# EAGLE design polarTRX (EAGLE 6.5.0)

## Sheet 1 of 2
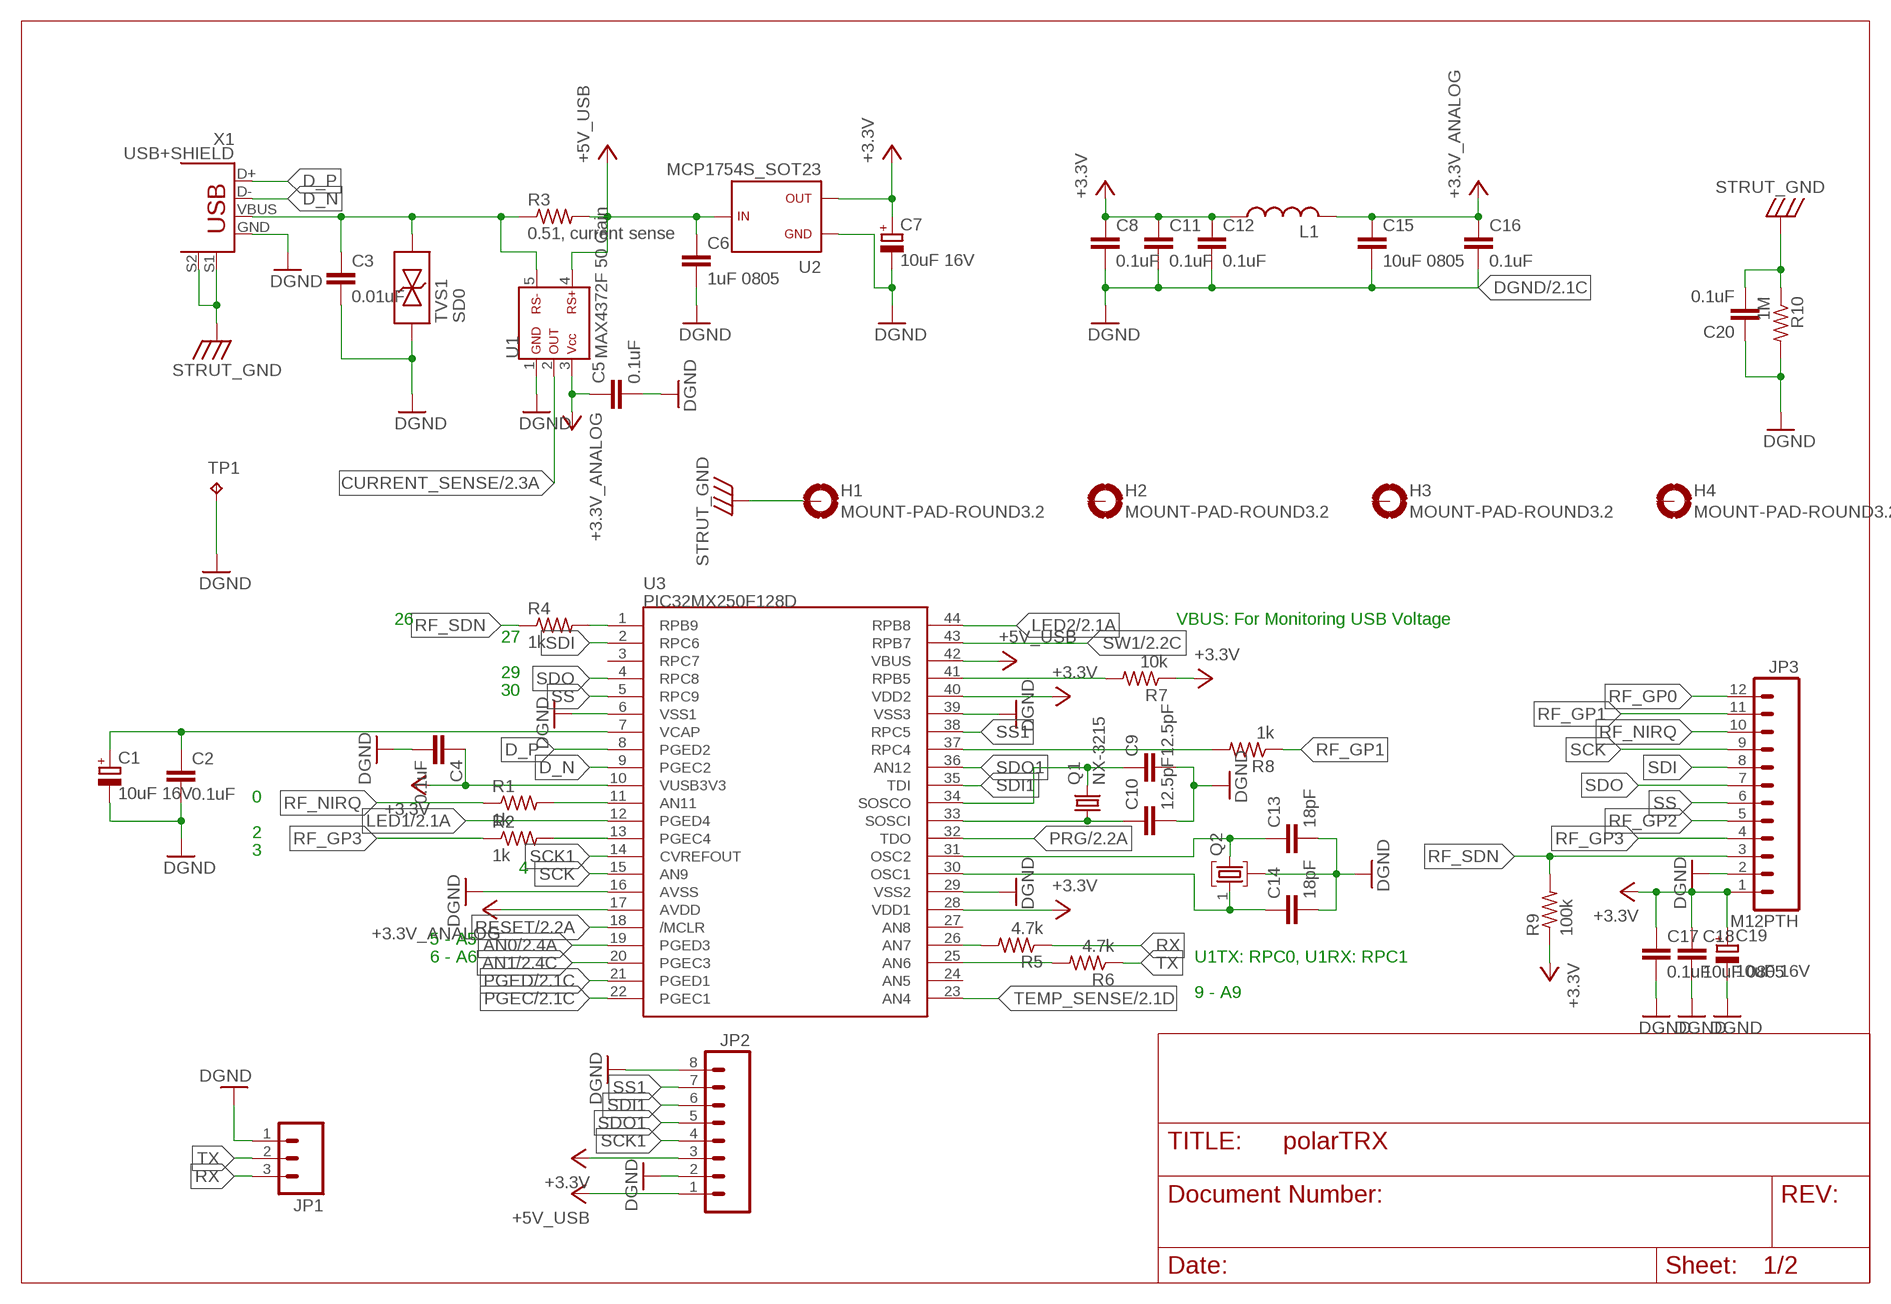
[diagram p0: schematic, sheet 1]

### Parts
C1  10uF 16V  C-TANTAL-A  [C1206(3216)-A]
C2  0.1uF  C0603(1608)  [C0603(1608)]
C3  0.01uF  C0603(1608)  [C0603(1608)]
C4  0.1uF  C0603(1608)  [C0603(1608)]
C5  0.1uF  C0603(1608)  [C0603(1608)]
C6  1uF 0805  C0805(2012)  [C0805(2012)]
C7  10uF 16V  C-TANTAL-A  [C1206(3216)-A]
C8  0.1uF  C0603(1608)  [C0603(1608)]
C9  12.5pF  C0603(1608)  [C0603(1608)]
C10  12.5pF  C0603(1608)  [C0603(1608)]
C11  0.1uF  C0603(1608)  [C0603(1608)]
C12  0.1uF  C0603(1608)  [C0603(1608)]
C13  18pF  C0603(1608)  [C0603(1608)]
C14  18pF  C0603(1608)  [C0603(1608)]
C15  10uF 0805  C0805(2012)  [C0805(2012)]
C16  0.1uF  C0603(1608)  [C0603(1608)]
C17  0.1uF  C0603(1608)  [C0603(1608)]
C18  10uF 0805  C0805(2012)  [C0805(2012)]
C19  10uF 16V  C-TANTAL-A  [C1206(3216)-A]
C20  0.1uF  C0603(1608)  [C0603(1608)]
H1  MOUNT-PAD-ROUND3.2  [3,2-PAD]
H2  MOUNT-PAD-ROUND3.2  [3,2-PAD]
H3  MOUNT-PAD-ROUND3.2  [3,2-PAD]
H4  MOUNT-PAD-ROUND3.2  [3,2-PAD]
JP1  M03PTH  [1X03]
JP2  M08SILK_FEMALE_PTH  [1X08]
JP3  M12PTH  [1X12]
L1  L0805(2012)  [L0805(2012)]
Q1  NX-3215  [NX-3215]
Q2  CRYSTAL  [HC_49US]
R1  1k  R0603(1608)  [R0603(1608)]
R2  1k  R0603(1608)  [R0603(1608)]
R3  0.51, current sense  R0805(2012)  [R0805(2012)]
R4  1k  R0603(1608)  [R0603(1608)]
R5  4.7k  R0603(1608)  [R0603(1608)]
R6  4.7k  R0603(1608)  [R0603(1608)]
R7  10k  R0603(1608)  [R0603(1608)]
R8  1k  R0603(1608)  [R0603(1608)]
R9  100k  R0603(1608)  [R0603(1608)]
R10  1M  R0603(1608)  [R0603(1608)]
TP1  TP  [TP-13]
TVS1  SD0  [SOD-323-NOPOL]
U1  MAX4372F 50 Gain  MAX4372  [SOT23-5DBV]
U2  MCP1754S_SOT23  [SOT23]
U3  PIC32MX250F128D  [TQFP44]
X1  USB+SHIELD  [USB-B-PTH]

### Nets
+3.3V: C4.1 C7.1(+) C8.1 C11.1 C12.1 C17.1 C18.1 C19.1(+) JP2.3 JP3.1 L1.1 R7.1 R9.1 U2.2 U3.10(VUSB3V3) U3.28(VDD1) U3.40(VDD2) ; also sheet 2
+3.3V_ANALOG: C5.1 C15.1 C16.1 L1.2 U1.3 U3.17(AVDD) ; also sheet 2
+5V_USB: C6.1 JP2.1 R3.2 U1.4 U2.3 U3.42(VBUS) ; also sheet 2
AN0: U3.19(PGED3) ; also sheet 2
AN1: U3.20(PGEC3) ; also sheet 2
CURRENT_SENSE: U1.2 ; also sheet 2
D_N: U3.9(PGEC2) X1.D-
D_P: U3.8(PGED2) X1.D+
DGND: C1.2(-) C2.2 C3.2 C4.2 C5.2 C6.2 C7.2(-) C8.2 C9.2 C10.2 C11.2 C12.2 C13.2 C14.2 C15.2 C16.2 C17.2 C18.2 C19.2(-) C20.1 JP1.1 JP2.2 JP2.8 JP3.2 Q2.2 R10.2 TP1.TP TVS1.1 U1.1 U2.1 U3.6(VSS1) U3.16(AVSS) U3.29(VSS2) U3.39(VSS3) X1.GND ; also sheet 2
LED1: U3.12(PGED4) ; also sheet 2
LED2: U3.44(RPB8) ; also sheet 2
N$4: C13.1 Q2.3 U3.31(OSC2)
N$5: C1.1(+) C2.1 U3.7(VCAP)
N$6: C14.1 Q2.1 U3.30(OSC1)
N$7: C3.1 R3.1 TVS1.2 U1.5 X1.VBUS
N$9: R1.2 U3.11(AN11)
N$10: R2.2 U3.13(PGEC4)
N$11: C9.1 Q1.2 U3.34(SOSCO)
N$12: C10.1 Q1.1 U3.33(SOSCI)
N$13: R8.2 U3.37(RPC4)
N$14: R6.2 U3.25(AN6)
N$15: R5.2 U3.26(AN7)
N$16: R7.2 U3.41(RPB5)
N$20: R4.2 U3.1(RPB9)
PGEC: U3.22(PGEC1) ; also sheet 2
PGED: U3.21(PGED1) ; also sheet 2
PRG: U3.32(TDO) ; also sheet 2
RESET: U3.18(/MCLR) ; also sheet 2
RF_GP0: JP3.12
RF_GP1: JP3.11 R8.1
RF_GP2: JP3.5
RF_GP3: JP3.4 R2.1
RF_NIRQ: JP3.10 R1.1
RF_SDN: JP3.3 R4.1 R9.2
RX: JP1.3 R5.1
SCK: JP3.9 U3.15(AN9)
SCK1: JP2.4 U3.14(CVREFOUT)
SDI: JP3.8 U3.2(RPC6)
SDI1: JP2.6 U3.35(TDI)
SDO: JP3.7 U3.4(RPC8)
SDO1: JP2.5 U3.36(AN12)
SS: JP3.6 U3.5(RPC9)
SS1: JP2.7 U3.38(RPC5)
STRUT_GND: C20.2 H1.B3,2(MOUNT) R10.1 X1.S1 X1.S2
SW1: U3.43(RPB7) ; also sheet 2
TEMP_SENSE: U3.23(AN4) ; also sheet 2
TX: JP1.2 R6.1
Unconnected: H2.B3,2(MOUNT) H3.B3,2(MOUNT) H4.B3,2(MOUNT) U3.3(RPC7) U3.24(AN5) U3.27(AN8)

### Notes on the sheet
- 26 | VBUS: For Monitoring USB Voltage
- 27
- 29
- 30
- 0
- 2
- 3
- 4
- 5 - A5
- 6 - A6 | U1TX: RPC0, U1RX: RPC1
- 9 - A9

## Sheet 2 of 2
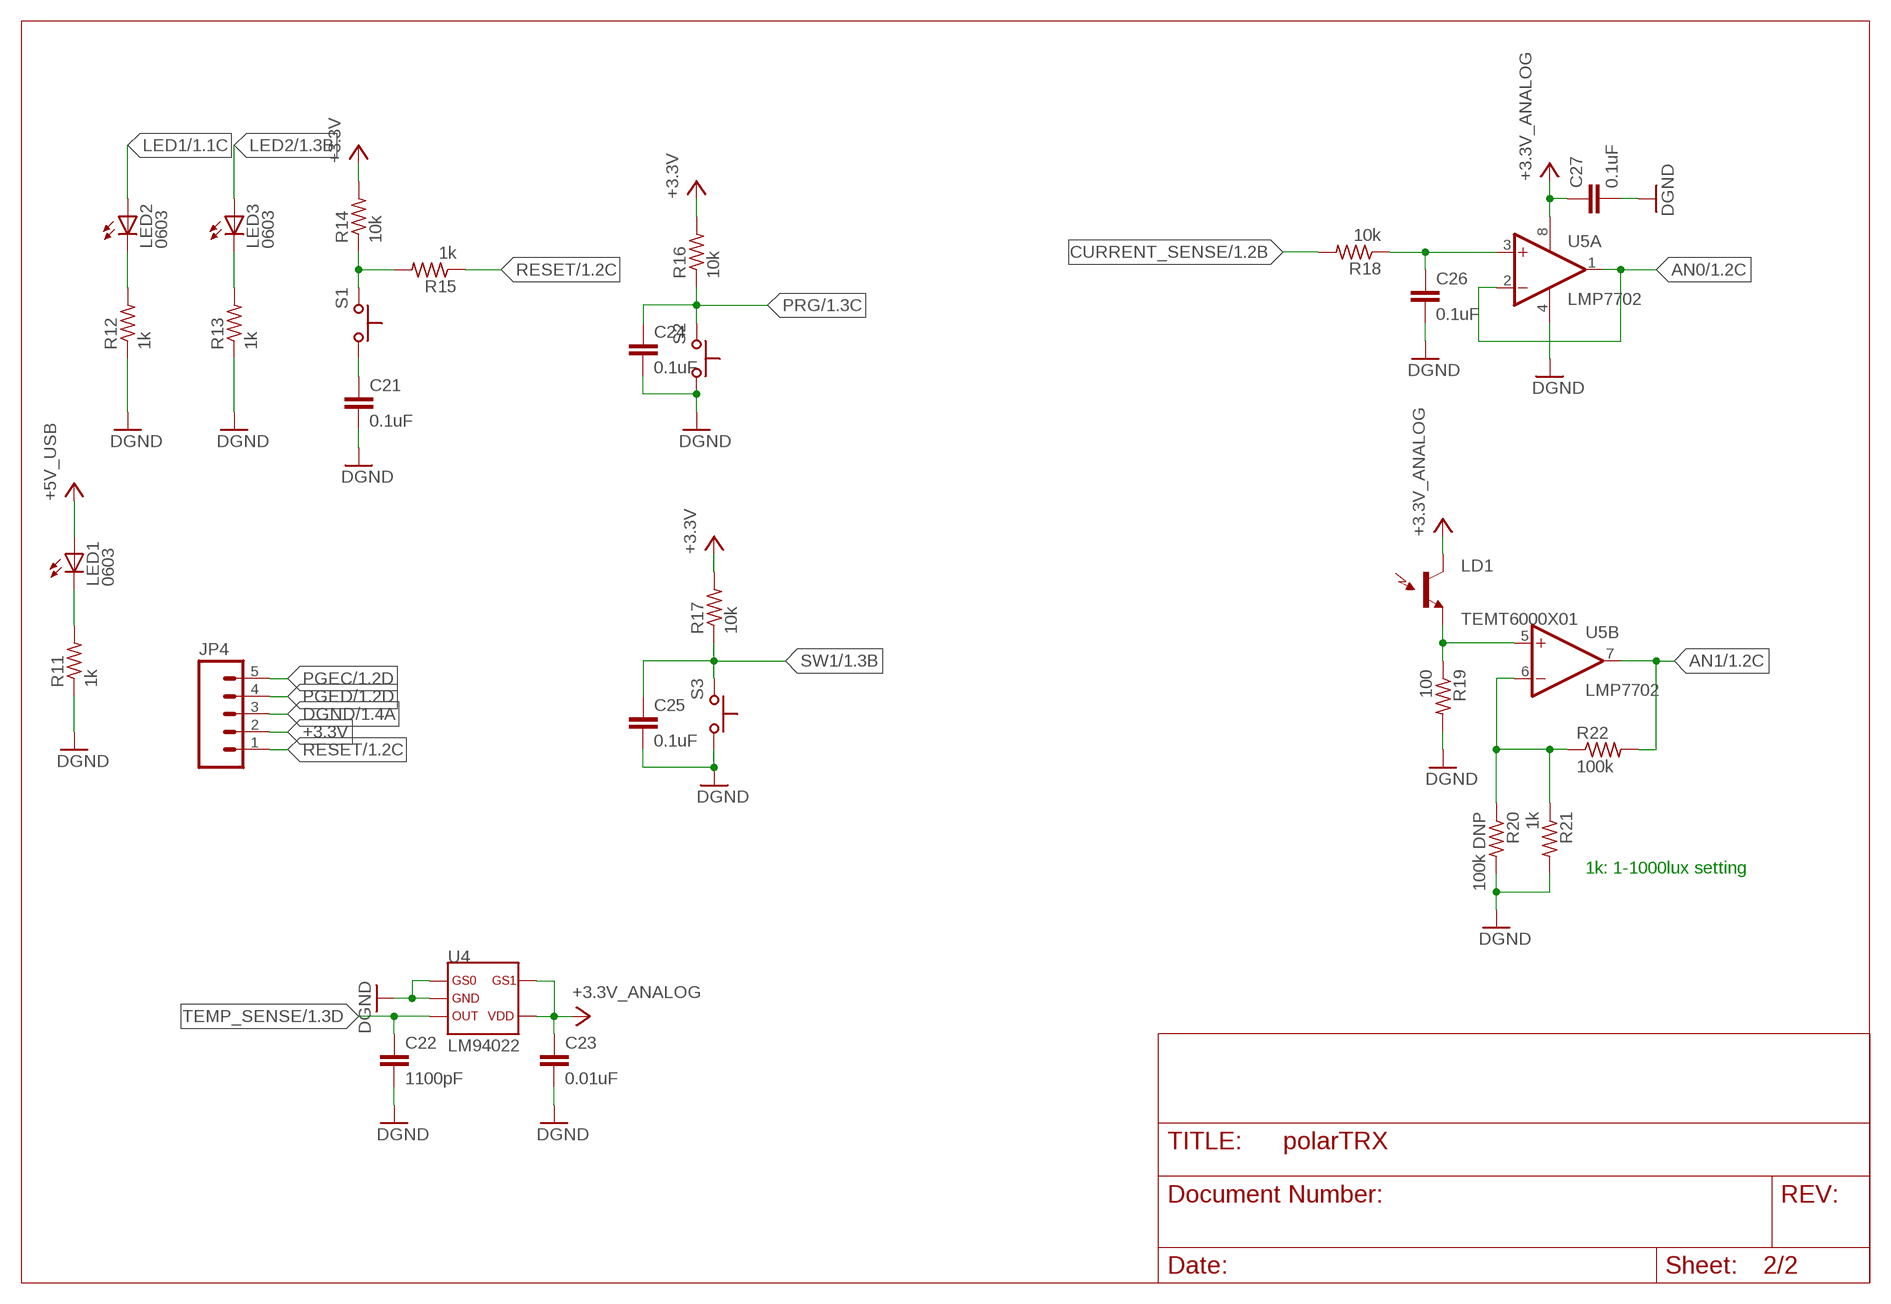
[diagram p1: schematic, sheet 2]

### Parts
C21  0.1uF  C0603(1608)  [C0603(1608)]
C22  1100pF  C0603(1608)  [C0603(1608)]
C23  0.01uF  C0603(1608)  [C0603(1608)]
C24  0.1uF  C0603(1608)  [C0603(1608)]
C25  0.1uF  C0603(1608)  [C0603(1608)]
C26  0.1uF  C0603(1608)  [C0603(1608)]
C27  0.1uF  C0603(1608)  [C0603(1608)]
JP4  M05PTH  [1X05]
LD1  TEMT6000X01  [TEMT6000-SEN]
LED1  0603  LED0603  [LED-0603]
LED2  0603  LED0603  [LED-0603]
LED3  0603  LED0603  [LED-0603]
R11  1k  R0603(1608)  [R0603(1608)]
R12  1k  R0603(1608)  [R0603(1608)]
R13  1k  R0603(1608)  [R0603(1608)]
R14  10k  R0603(1608)  [R0603(1608)]
R15  1k  R0603(1608)  [R0603(1608)]
R16  10k  R0603(1608)  [R0603(1608)]
R17  10k  R0603(1608)  [R0603(1608)]
R18  10k  R0603(1608)  [R0603(1608)]
R19  100  R0603(1608)  [R0603(1608)]
R20  100k DNP  R0603(1608)  [R0603(1608)]
R21  1k  R0603(1608)  [R0603(1608)]
R22  100k  R0603(1608)  [R0603(1608)]
S1  SWITCH  [SKHLACA010]
S2  SWITCH  [SKHLACA010]
S3  SWITCH  [SKHLACA010]
U4  LM94022  [SC70-5]
U5  LMP7702  [DGK_S-DPSO-G8]

### Nets
+3.3V: JP4.2 R14.2 R16.2 R17.2 ; also sheet 1
+3.3V_ANALOG: C23.1 C27.1 LD1.COLLECTOR(C1) U4.4 U4.5 U5.8(V+) ; also sheet 1
+5V_USB: LED1.A ; also sheet 1
AN0: U5.1(A:OUT) U5.2(A:-IN) ; also sheet 1
AN1: R22.2 U5.7(B:OUT) ; also sheet 1
CURRENT_SENSE: R18.2 ; also sheet 1
DGND: C21.2 C22.2 C23.2 C24.2 C25.2 C26.2 C27.2 JP4.3 R11.1 R12.1 R13.1 R19.2 R20.2 R21.2 S2.P$2 S3.P$2 U4.1 U4.2 U5.4(V-) ; also sheet 1
LED1: LED2.A ; also sheet 1
LED2: LED3.A ; also sheet 1
N$1: R14.1 R15.2 S1.P$1
N$2: C21.1 S1.P$2
N$17: LED1.C R11.2
N$18: LED2.C R12.2
N$19: LED3.C R13.2
N$21: C26.1 R18.1 U5.3(A:+IN)
N$22: LD1.EMITTER(E1) R19.1 U5.5(B:+IN)
N$23: R20.1 R21.1 R22.1 U5.6(B:-IN)
PGEC: JP4.5 ; also sheet 1
PGED: JP4.4 ; also sheet 1
PRG: C24.1 R16.1 S2.P$1 ; also sheet 1
RESET: JP4.1 R15.1 ; also sheet 1
SW1: C25.1 R17.1 S3.P$1 ; also sheet 1
TEMP_SENSE: C22.1 U4.3 ; also sheet 1

### Notes on the sheet
- 1k: 1-1000lux setting

## Library data of the parts
C1 C7 C19 = berry:C-TANTAL-A: TAJA105M020RNJ Tantal Capacitor Manufacturer: AVX 1206(3126) Ref: www.avx.com/docs/techinfo/tantappl.pdf
C2-C6 C8-C18 C21-C27 = polarinstruments:C
C20 = yBrainDigital:C
H1-H4 = yBrainDigital:MOUNT-PAD-ROUND: MOUNTING PAD, round
JP1 = SparkFun-Connectors:M03: Header 3 Standard 3-pin 0.1" header. Use with straight break away headers (SKU : PRT-00116), right angle break away headers (PRT-00553), swiss pins (PRT-00743), machine pins (PRT-00117), and female headers (PRT-00115). Molex polarized connector foot print use with SKU : PRT-08232 with associated crimp pins and housings.
JP2 = SparkFun-Connectors:M08: Header 8 Standard 8-pin 0.1" header. Use with straight break away headers (SKU : PRT-00116), right angle break away headers (PRT-00553), swiss pins (PRT-00743), machine pins (PRT-00117), and female headers (PRT-00115).; PROD_ID: CONN-08438
JP3 = SparkFun-Connectors:M12: Header 12 Standard 12-pin 0.1" header. Use with straight break away headers (SKU : PRT-00116), right angle break away headers (PRT-00553), swiss pins (PRT-00743), machine pins (PRT-00117), and female headers (PRT-00115).
JP4 = SparkFun-Connectors:M05: Header 5 Standard 5-pin 0.1" header. Use with straight break away headers (SKU : PRT-00116), right angle break away headers (PRT-00553), swiss pins (PRT-00743), machine pins (PRT-00117), and female headers (PRT-00115). Molex polarized connector foot print use with SKU : PRT-08230 with associated crimp pins and housings.
L1 = polarinstruments:L
LD1 = polarinstruments:TEMT6000: Ambient Light Sensor Simple light detection sensor. Output varies with light intensity input. Spark Fun Electronics SKU : COM-08348
LED1-LED3 = SparkFun:LED: LEDs Standard schematic elements and footprints for 5mm, 3mm, 1206, and 0603 sized LEDs. 5mm - Spark Fun Electronics SKU : COM-00529 (and others)
Q1 = polarinstruments:NX-3215: NDK 32.768 kHz SMD Crystal P/N: NX3215SA-32.768K-STD-MUS-2 Nominal frequency (kHz): 32.768 Package Size (L×W×H : mm): 3.2×1.5×0.8 Operating Temperature Range(*1) / Storage Temperature Range (°C): -40 to +85 / -40 to +85 Level of drive: 0.1µW (Max. 0.5µW) Frequency Tolerance (25±3°C): ±20×10-6 Load Capacitance: 9.0pF, 12.5pF Equivalent Series Resistance: 70kΩ Max. Ordering Code: NX3215SA-32.768K-STD-MUA-9 (Load Capacitance9.0pF) /NX3215SA-32.768K-STD-MUA-8 (Load Capacitance12.5pF)
Q2 = polarinstruments:CRYSTAL
R1-R9 R11-R22 = polarinstruments:R
R10 = yBrainDigital:R
S1-S3 = polarinstruments:SWITCH
TP1 = polarinstruments:TP
TVS1 = polarinstruments:SD0
U1 = polarinstruments:MAX4372
U2 = polarinstruments:MCP1754S: MCP1754s high PSRR LDO from Microchips
U3 = polarinstruments:PIC32MX250F128D
U4 = polarinstruments:LM94022: LM94022 Temp Sensor From TI
U5 = polarinstruments:LMP7702
X1 = polarinstruments:USB+SHIELD: USB+Shield USB connector with shield pins connectable

## Board
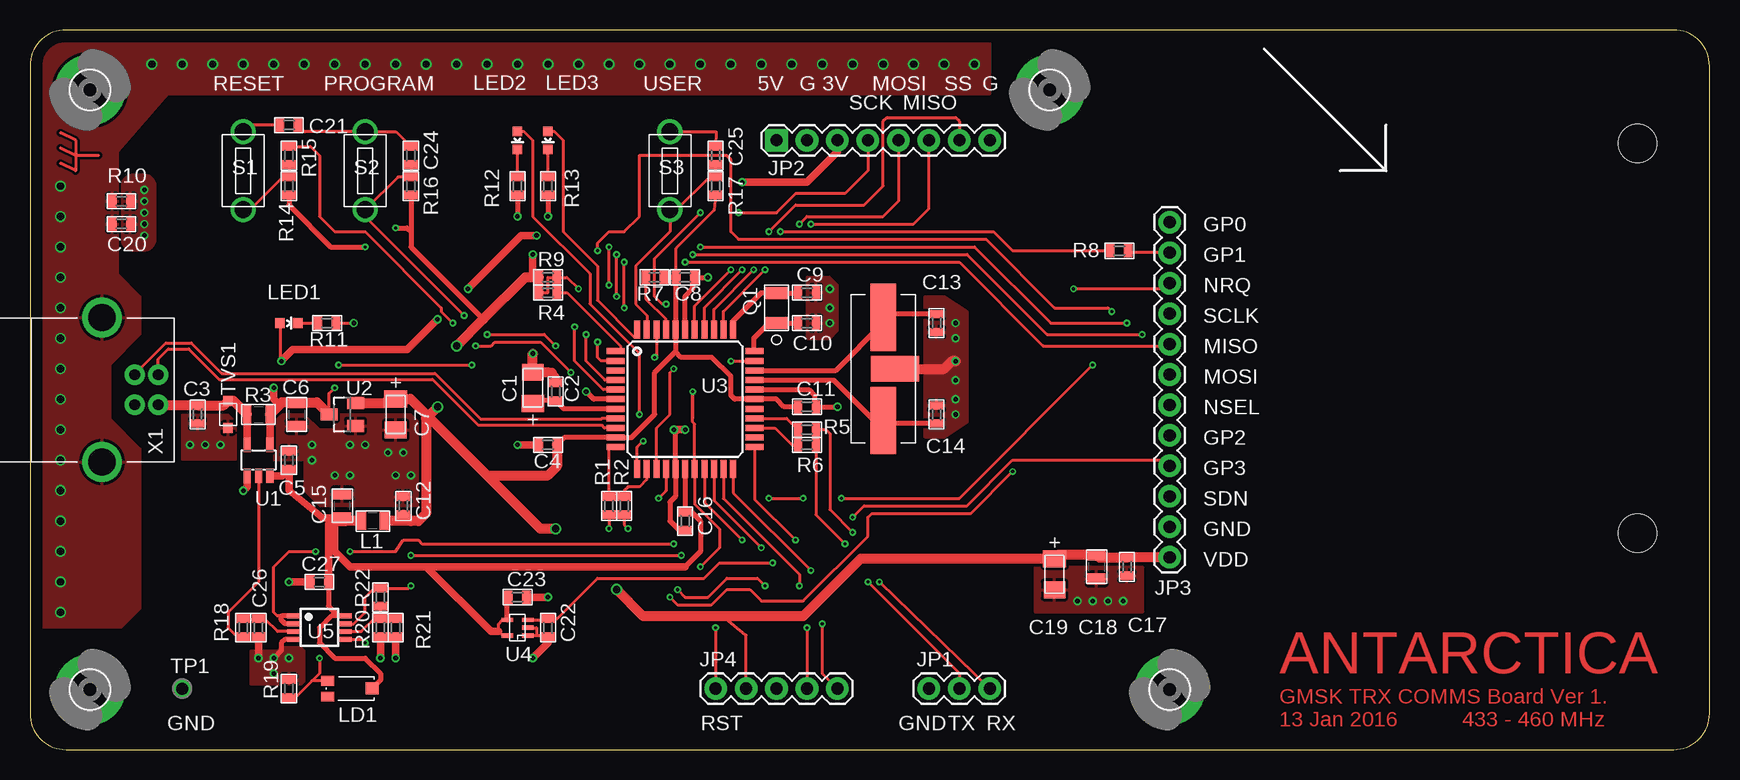
[diagram p2: board, top side]
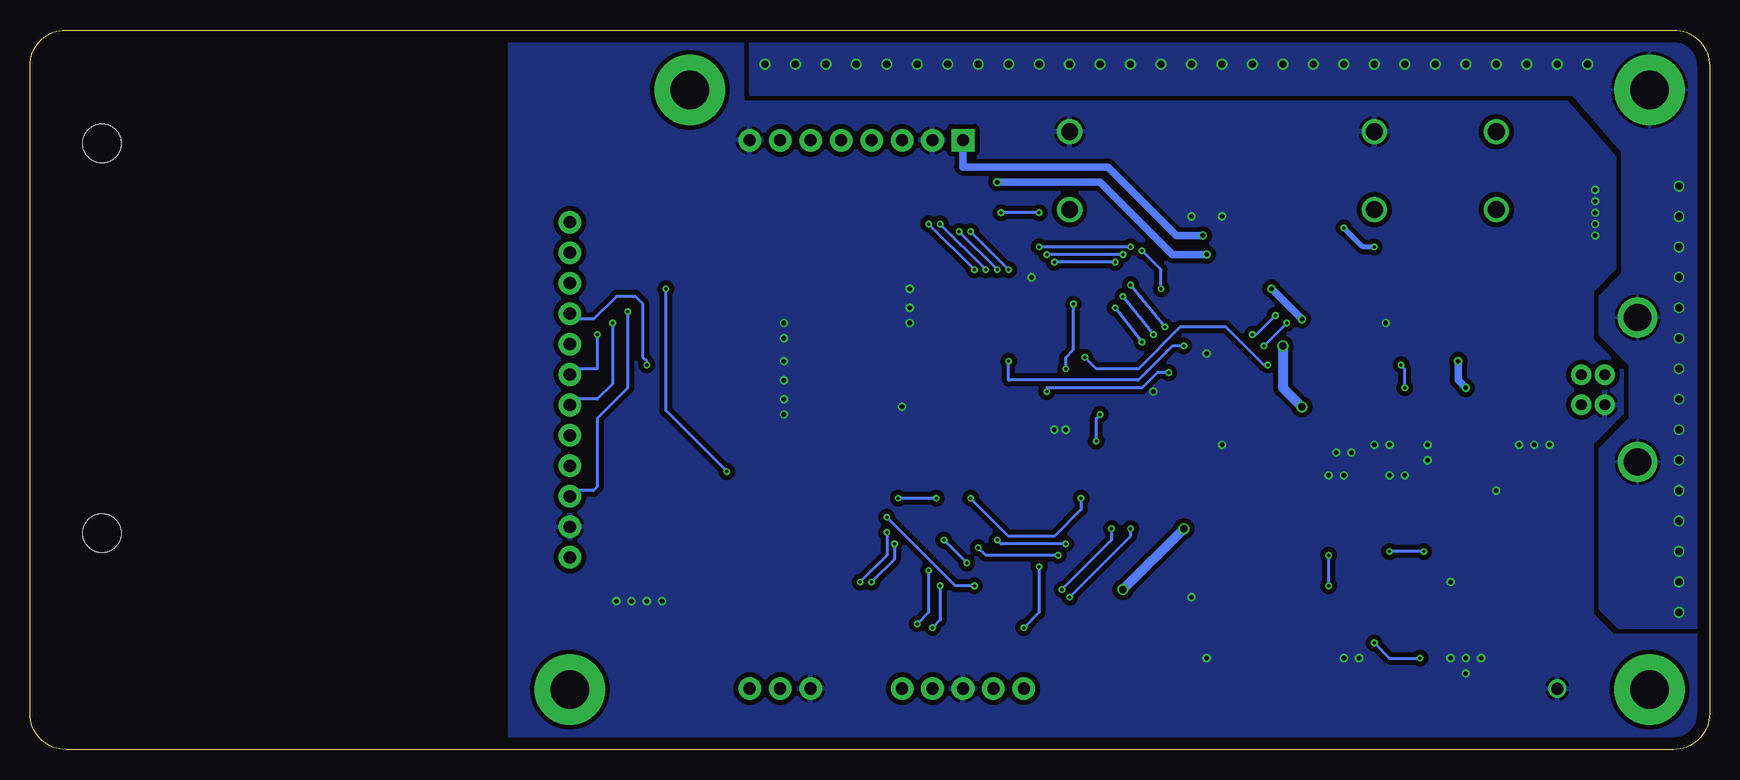
[diagram p3: board, bottom side, seen from below]

Size 140 x 60 mm. Coordinates in mm from the lower left corner, seen from the top.
Outline: 3,0 137,0 arc90 140,3 140,57 arc90 137,60 3,60 arc90 0,57 0,3 arc90 3,0
Copper layers (1*16): Top 0.035mm / dielectric 1.5mm / Bottom 0.035mm
Design rules "default *": minimum track width 10mil, minimum drill 10mil, track to track 8mil, track to pad 8mil, pad to pad 8mil, via to via 8mil, smd to smd 8mil, copper to edge 40mil, drill to drill 8mil, minimum pad ring 10mil, minimum via ring 6mil, stop-mask expansion 4mil, vias tented up to drill 0mil, thermal gap 10mil
Holes 3.2 mm at 134,18.03 134,50.53

### Footprints (pad centres in the part's own frame; a part is rotated, then mirrored left to right if it is on the bottom)
C1206(3216)-A = smd 1.4 x 1.9: 1 -1.3,0 | smd 1.4 x 1.8: 2 1.3,0
C0603(1608) = smd 0.7 x 1.1: 1 -0.75,0; 2 0.75,0
C0805(2012) = smd 0.9 x 1.5: 1 -1,0; 2 1,0
3,2-PAD = drill 3.2 pad 5.842: B3,2 0,0
1X03 = drill 1.016 pad 1.88: 1 0,0; 2 2.54,0; 3 5.08,0
1X08 = drill 1.016 pad 1.88 square: 1 0,0 | drill 1.016 pad 1.88: 2 2.54,0; 3 5.08,0; 4 7.62,0; 5 10.16,0; 6 12.7,0; 7 15.24,0; 8 17.78,0
1X12 = drill 1.016 pad 1.88: 1 0,0; 2 2.54,0; 3 5.08,0; 4 7.62,0; 5 10.16,0; 6 12.7,0; 7 15.24,0; 8 17.78,0; 9 20.32,0; 10 22.86,0; 11 25.4,0; 12 27.94,0
1X05 = drill 1.016 pad 1.88: 1 0,0; 2 2.54,0; 3 5.08,0; 4 7.62,0; 5 10.16,0
L0805(2012) = smd 0.9 x 1.5: 1 -1,0; 2 1,0
TEMT6000-SEN = smd 1.1 x 0.8: BASE -1.87,-0.65; EMITTER -1.87,0.65 | smd 1.1 x 1: COLLECTOR 1.86,0.01
LED-0603 = smd 0.8 x 0.8: A 0,-0.75; C 0,0.75
NX-3215 = smd 1 x 1.8: 1 -1.25,0; 2 1.25,0
HC_49US = smd 5.6 x 2.1: 1 -4.3,0; 3 4.3,0 | smd 2.1 x 4: 2 0,-1
R0603(1608) = smd 0.7 x 1.1: 1 -0.75,0; 2 0.75,0
R0805(2012) = smd 0.7 x 1.5: 1 -0.95,0; 2 0.95,0
SKHLACA010 = drill 1.4: P$1 -3.25,0; P$2 3.25,0
TP-13 = drill 1: TP 0,0
SOD-323-NOPOL = smd 0.8 x 0.8: 1 -1.125,0; 2 1.125,0
SOT23-5DBV = smd 0.6 x 1.22: 1 -0.95,-1.3; 2 0,-1.3; 3 0.95,-1.3; 4 0.95,1.3; 5 -0.95,1.3
SOT23 = smd 1 x 1.4: 1 -0.95,-1.1; 2 0.95,-1.1; 3 0,1.1
TQFP44 = smd 1.5 x 0.5: 1 -5.8,4; 2 -5.8,3.2; 3 -5.8,2.4; 4 -5.8,1.6; 5 -5.8,0.8; 6 -5.8,0; 7 -5.8,-0.8; 8 -5.8,-1.6; 9 -5.8,-2.4; 10 -5.8,-3.2; 11 -5.8,-4; 23 5.8,-4; 24 5.8,-3.2; 25 5.8,-2.4; 26 5.8,-1.6; 27 5.8,-0.8; 28 5.8,0; 29 5.8,0.8; 30 5.8,1.6; 31 5.8,2.4; 32 5.8,3.2; 33 5.8,4 | smd 0.5 x 1.5: 12 -4,-5.8; 13 -3.2,-5.8; 14 -2.4,-5.8; 15 -1.6,-5.8; 16 -0.8,-5.8; 17 0,-5.8; 18 0.8,-5.8; 19 1.6,-5.8; 20 2.4,-5.8; 21 3.2,-5.8; 22 4,-5.8; 34 4,5.8; 35 3.2,5.8; 36 2.4,5.8; 37 1.6,5.8; 38 0.8,5.8; 39 0,5.8; 40 -0.8,5.8; 41 -1.6,5.8; 42 -2.4,5.8; 43 -3.2,5.8; 44 -4,5.8
SC70-5 = smd 0.36 x 0.95: 1 -0.65,-0.85; 2 0,-0.85; 3 0.65,-0.85; 4 0.65,0.85; 5 -0.65,0.85
DGK_S-DPSO-G8 = smd 0.4 x 1: 1 -0.975,-2.2; 2 -0.325,-2.2; 3 0.325,-2.2; 4 0.975,-2.2; 5 0.975,2.2; 6 0.325,2.2; 7 -0.325,2.2; 8 -0.975,2.2
USB-B-PTH = drill 0.914 pad 1.676: D+ 2.718,1.25; D- 4.699,1.25; GND 2.718,-1.25; VBUS 4.699,-1.25 | drill 2.286: S1 0,-6.02; S2 0,6.02

### Placement (x,y rotation side)
C1  41.91,30.16 90 top
C2  43.81,29.84 90 top
C3  13.97,27.94 270 top
C4  43.18,25.4 180 top
C5  21.59,24.13 90 top
C6  22.23,27.94 270 top
C7  30.48,27.94 270 top
C8  54.61,39.37 0 top
C9  64.77,38.1 0 top
C10  64.77,35.56 0 top
C11  64.77,28.57 0 top
C12  31.11,20.32 90 top
C13  75.56,35.56 270 top
C14  75.56,27.94 90 top
C15  26.04,20.32 90 top
C16  54.61,19.05 270 top
C17  91.44,15.24 270 top
C18  88.9,15.24 270 top
C19  85.41,14.61 270 top
C20  7.62,43.81 180 top
C21  21.59,52.07 0 top
C22  43.18,10.16 270 top
C23  40.64,12.7 0 top
C24  31.75,49.53 90 top
C25  57.15,49.53 90 top
C26  19.05,10.16 270 top
C27  24.13,13.97 180 top
H1  5,55 0 top
H2  85,55 0 top
H3  5,5 0 top
H4  95,5 0 top
JP1  74.93,5.08 0 top
JP2  62.23,50.8 0 top
JP3  95,16.03 90 top
JP4  57.15,5.08 0 top
L1  28.57,19.05 180 top
LD1  26.67,5.08 0 top
LED1  21.59,35.56 270 top
LED2  40.64,50.8 180 top
LED3  43.18,50.8 180 top
Q1  62.23,36.83 90 top
Q2  71.12,31.75 90 top
R1  48.26,20.32 90 top
R2  49.53,20.32 90 top
R3  19.05,27.94 0 top
R4  43.18,38.1 0 top
R5  64.77,26.67 180 top
R6  64.77,25.4 180 top
R7  52.07,39.37 180 top
R8  90.81,41.59 180 top
R9  43.18,39.37 0 top
R10  7.62,45.72 0 top
R11  24.77,35.56 180 top
R12  40.64,46.99 90 top
R13  43.18,46.99 90 top
R14  21.59,46.99 270 top
R15  21.59,49.53 270 top
R16  31.75,46.99 270 top
R17  57.15,46.99 270 top
R18  17.78,10.16 270 top
R19  21.59,5.08 90 top
R20  29.21,10.16 270 top
R21  30.48,10.16 270 top
R22  29.21,12.7 90 top
S1  17.78,48.26 90 top
S2  27.94,48.26 90 top
S3  53.34,48.26 90 top
TP1  12.7,5.08 0 top
TVS1  16.51,27.94 90 top
U1  19.05,24.13 0 top
U2  26.04,27.94 90 top
U3  54.61,29.21 0 top
U4  40.64,10.16 90 top
U5  24.13,10.16 270 top
X1  6,30 0 top

### Tracks (layer width: path | path; a pad name or v marks a point on that pad's centre or on a via)
+3.3V  (via drill 0.25, 0.38, 0.61)
  Top 0.254: JP4.2 59.69,9.53 57.78,11.11 | R17.2 57.03,44.97 53.86,41.8 C8.1
  Top 0.406: C4.1 44.54,26.01 U3.10 50.14,26.01 52.07,27.94 52.07,31.43 53.81,33.17 | R7.1 C8.1 53.86,35.01 U3.40 53.81,33.17 | C11.1 62.87,28.57 62.23,29.21 U3.28 58.74,29.21 58.42,29.53 58.42,31.11 56.83,32.7 54.28,32.7 53.81,33.17 | R16.2 31.75,43.18 | 31.75,43.18 31.75,41.91 37.78,35.88 | R14.2 21.59,45.4 25.08,41.91 v27.94,41.91 | v30.48,43.5 31.43,43.5 31.75,43.18
  Top 0.61: JP2.3 67.31,49.85 64.77,47.31 v59.37,47.31 | v41.91,41.27 41.91,39.37
  Top 0.813: U2.2 29.5,28.89 C7.1 31.72,29.24 33.02,27.94 | 33.02,27.94 33.02,27.62 | 33.02,27.62 33.02,19.68 32.38,19.05 31.75,19.05 | 31.75,19.05 L1.1 | C12.1 31.75,19.05 | JP3.1 91.48,16.03 C17.1 89.15,15.99 C18.1 85.74,16.24 C19.1 69.25,15.9 64.45,11.11 57.78,11.11 51.12,11.11 v48.9,13.34 | 33.02,27.94 38.1,22.86 | 38.1,22.86 43.18,22.86 43.93,23.61 C4.1 | v43.81,18.41 42.55,18.41 38.1,22.86 | R9.1 41.91,39.37 41.27,39.37 37.78,35.88 v35.56,33.66 | v33.97,28.57 33.02,27.62
  Bottom 0.406: v27.94,41.91 28.89,41.91 v30.48,43.5
  Bottom 0.61: v59.37,47.31 50.8,47.31 44.77,41.27 v41.91,41.27
  Bottom 0.813: v48.9,13.34 v43.81,18.41 | v35.56,33.66 35.56,30.16 v33.97,28.57
+3.3V_ANALOG
  Top 0.254: U4.5 39.38,9.51 39.05,9.84 39.05,10.48 39.37,10.79 39.77,10.79 U4.4
  Top 0.406: U3.17 C16.1 55.13,19.8 55.88,19.05 55.88,16.51 54.61,15.24 | C27.1 24.88,11.95 25.7,11.13 U5.8 25.11,11.13 24.13,10.16 24.13,8.89 25.4,7.62 27.94,7.62 29.21,6.35 29.21,5.77 LD1.COLLECTOR | U4.4 39.79,12.6 C23.1
  Top 0.61: U1.3 21.04,22.83 C5.1 21.59,21.59 24.38,19.32 25.4,19.32 | C15.1 25.4,19.32 | C27.1 24.88,18.8 25.4,19.32 | 39.05,9.84 38.42,9.84 33.02,15.24 | 33.02,15.24 26.67,15.24 25.4,16.51 25.4,19.05 | 54.61,15.24 33.02,15.24
  Top 0.813: L1.2 26.3,19.05 | 25.4,19.05 26.3,19.05 | 26.3,19.05 C15.1
+5V_USB  (via drill 0.25, 0.38)
  Top 0.254: U2.3 24.93,29.7 v25.4,30.16 | v25.72,32.07 v36.83,32.07 | U3.42 52.21,32.84 v52.07,32.7 | LED1.A 20.84,32.5 v20.95,32.38
  Top 0.61: U1.4 R3.2 | v42.23,42.86 40.96,42.86 v36.51,38.42 | v33.97,35.88 31.43,33.34 21.91,33.34 v20.95,32.38 | v20.32,30.16 20.32,29.21 20.8,28.73
  Top 0.813: R3.2 20.8,28.73 21,28.94 C6.1 23.93,28.94 U2.3
  Bottom 0.254: v25.4,30.16 25.4,31.75 v25.72,32.07 | v36.83,32.07 37.15,32.07 40.32,35.24 44.13,35.24 47.62,31.75 51.12,31.75 v52.07,32.7
  Bottom 0.61: JP2.1 62.23,48.58 50.16,48.58 44.45,42.86 v42.23,42.86 | v36.51,38.42 v33.97,35.88 | v20.95,32.38 20.95,30.8 v20.32,30.16
AN0  (via drill 0.25)
  Top 0.254: U3.19 56.21,20.62 v59.37,17.46 | U5.1 20.61,11.13 20.32,11.43 20.32,15.24 21.59,16.51 v23.81,16.51 | v26.67,16.51 30.48,16.51 31.11,17.46 32.38,17.46 32.7,17.14 v53.66,17.14
  Top 0.406: U5.2 21.27,10.48 20.95,10.79 20.95,11.11 20.98,11.13 U5.1
  Bottom 0.254: v23.81,16.51 v26.67,16.51 | v53.66,17.14 59.05,17.14 v59.37,17.46
AN1  (via drill 0.25)
  Top 0.254: U5.7 27,10.48 27.94,11.43 27.94,12.7 28.69,13.45 R22.2 31.55,13.45 v31.75,13.65 | U3.20 57.01,20.78 v60.96,16.83 | v31.75,16.19 v54.29,16.19
  Bottom 0.254: v31.75,13.65 v31.75,16.19 | v54.29,16.19 60.33,16.19 v60.96,16.83
CURRENT_SENSE
  Top 0.254: U1.2 19.05,13.97 16.51,11.43 16.51,10.16 17.26,9.41 R18.2
D_N
  Top 0.254: X1.D- 10.7,32.56 11.54,33.4 13.23,33.4 15.77,30.86 33.55,30.86 37.36,27.05 47.62,27.05 47.87,26.81 U3.9
D_P
  Top 0.254: X1.D+ 8.72,31.3 11.32,33.91 13.44,33.91 15.98,31.37 33.76,31.37 37.57,27.56 47.62,27.56 47.68,27.61 U3.8
DGND  (via drill 0.38)
  Top 0.254: S3.P$2 57.19,51.51 C25.2 | C24.2 30.52,51.51 S2.P$2 22.9,51.51 C21.2 | U4.1 42.23,9.51 | 42.23,9.51 42.56,9.51 43.18,8.89 | U4.2 42.23,10.16 42.23,9.51 | R11.1 v26.99,35.56
  Top 0.406: C16.2 54.09,18.3 53.34,19.05 53.34,20.64 53.81,21.11 U3.16 53.81,26.5 v54.61,26.67 | U5.4 21.25,9.19 20.95,8.89 20.95,8.26 v20.32,7.62 | U3.29 64.92,30.01 65.41,29.53 65.41,28.69 C11.2 v67.31,28.57 | U3.6 46.99,29.21 v46.35,29.84 | v56.52,39.37 C8.2 55.36,38.85 55.24,38.73 55.24,38.42 54.61,37.78 U3.39 | R12.1 v40.64,44.45 | R13.1 v43.18,44.45
  Top 0.61: U1.1 18.1,21.91 v17.78,21.59 | C23.2 v43.18,12.7 | C22.2 43.18,8.89 v41.91,7.62 | R20.2 v29.21,7.62 | R21.2 v30.48,7.62 | C26.2 v19.05,7.62 | C27.2 v21.59,13.97 | v54.61,26.67 v53.66,26.67 | C4.2 v40.64,25.4 | C2.2 43.81,31.11 43.5,31.43
  Top 0.813: Q2.2 76.2,31.75 76.83,32.38 v77.15,32.38 | v41.91,33.02 C1.2 43.15,31.46 43.5,31.43
  other vias: 30.48,22.86 29.84,24.77 26.67,22.86 31.75,22.86 25.4,22.86 23.5,25.4 26.67,25.4 27.94,25.4 23.5,24.13 31.11,24.77 13.34,25.4 14.61,25.4 15.88,25.4 66.67,35.56 66.67,36.83 66.67,38.42 77.15,35.56 77.15,27.94 77.15,29.21 77.15,30.8 77.15,34.29 9.53,45.72 9.53,43.81 9.53,44.77 9.53,46.67 9.53,42.86 87.31,12.38 88.58,12.38 89.85,12.38 91.12,12.38 21.59,7.62 20.32,6.35
  pour Top: 30.48,27.94 25.4,27.94 25.4,26.67 24.13,26.67 22.86,27.94 20.32,27.94 20.32,24.13 22.86,24.13 22.86,21.59 24.13,20.32 33.02,20.32 33.02,26.67 31.75,27.94
  pour Bottom (isolate 0.406, rank 2): 0,60.33 100,60.33 100,-0.64 0,-0.64
  pour Top: 12.7,27.94 16.51,27.94 17.14,27.3 17.14,24.13 12.7,24.13
  pour Top: 64.77,39.37 64.77,34.29 66.67,34.29 67.31,34.92 67.31,38.73 66.67,39.37
  pour Top: 74.61,37.78 76.2,37.78 78.11,36.51 78.11,27.3 76.2,26.04 74.61,26.04
  pour Top (rank 2): 7.62,46.94 7.62,42.59 arc90 8.62,41.59 9.48,41.59 arc90 10.48,42.59 10.48,46.94 arc90 9.48,47.94 8.62,47.94 arc90
  pour Top: 83.82,15.24 92.71,15.24 92.71,11.43 83.82,11.43
  pour Top: 18.41,8.26 20.64,8.26 20.95,8.57 22.54,8.57 22.86,8.26 22.86,5.4 18.41,5.4
LED1  (via drill 0.25)
  Top 0.254: LED2.A 41.16,51.55 41.91,50.8 41.91,44.45 46.67,39.69 46.67,37.15 50.8,33.02 v50.8,27.94 | U3.12 50.61,25.21 v51.12,25.72
  Bottom 0.254: v51.12,25.72 51.12,27.62 v50.8,27.94
LED2
  Top 0.254: LED3.A 43.7,51.55 44.45,50.8 44.45,43.18 47.31,40.32 47.31,37.47 50.4,34.38 50.61,34.59 U3.44
N$1
  Top 0.254: S1.P$1 18.34,45.01 21.07,47.74 R14.1 R15.2
N$2
  Top 0.254: C21.1 18.34,52.07 S1.P$2
N$3
  Top 0.254: 5.71,49.53 3.81,49.53
N$4
  Top 0.406: U3.31 67.17,31.61 71.12,35.56 | Q2.3 71.12,35.56 | C13.1 71.87,36.31 71.12,35.56
N$5
  Top 0.406: U3.7 44.5,28.41 C2.1 41.99,29.09 C1.1
N$6
  Top 0.406: U3.30 66.98,30.81 70.48,27.3 70.97,27.3 Q2.1 | Q2.1 71.12,27.94 | C14.1 71.38,27.19 Q2.1
N$7
  Top 0.61: R3.1 U1.5
  Top 0.813: X1.VBUS 13.91,28.75 C3.1 16.14,28.69 TVS1.2 16.98,29.07 R3.1
N$8
  Top 0.254: 3.81,49.53 3.81,50.8 2.54,51.44 | 3.81,49.53 3.81,48.26 2.54,48.9 | 3.81,49.53 2.54,50.16
N$9
  Top 0.254: R1.2 48.26,25.12 U3.11
N$10
  Top 0.254: U3.13 51.41,22.52 50.8,21.91 49.85,21.91 49.53,21.59 R2.2
N$11
  Top 0.406: U3.34 58.61,35.75 60.96,38.1 62.21,38.1 Q1.2 64,38.08 C9.1
N$12
  Top 0.406: U3.33 60.33,33.3 60.33,34.29 61.62,35.58 Q1.1 64,35.58 C10.1
N$13  (via drill 0.25)
  Top 0.254: U3.37 56.21,36.84 v59.37,40.01 | v62.55,43.18 80.33,43.18 81.92,41.59 R8.2
  Bottom 0.254: v59.37,40.01 v62.55,43.18
N$14
  Top 0.254: U3.25 62.09,26.81 63.5,25.4 R6.2
N$15
  Top 0.254: U3.26 63.08,27.61 R5.2
N$16
  Top 0.254: R7.2 51.32,37.58 53.01,35.89 U3.41
N$17
  Top 0.254: LED1.C R11.2
N$18
  Top 0.254: R12.2 LED2.C
N$19
  Top 0.254: R13.2 LED3.C
N$20
  Top 0.254: R4.2 44.77,38.1 49.21,33.66 49.21,33.34 48.94,33.34 U3.1
N$21
  Top 0.254: R18.1 C26.1 19.57,10.91 20.64,9.84 U5.3
N$22  (via drill 0.25)
  Top 0.254: LD1.EMITTER 23.51,5.73 | R19.1 22.11,4.33 23.51,5.73 | U5.5 27.64,9.19 v27.94,8.89 | v24.13,7.62 24.13,6.35 23.51,5.73
  Bottom 0.254: v27.94,8.89 26.67,7.62 v24.13,7.62
N$23
  Top 0.254: R20.1 R21.1 | R20.1 R22.1 | U5.6 27.61,9.84 28.69,10.91 R20.1
PGEC  (via drill 0.25)
  Top 0.254: U3.22 58.61,21.4 v65.09,14.92 | v66.04,10.48 66.04,6.35 JP4.5
  Bottom 0.254: v65.09,14.92 65.09,11.43 v66.04,10.48
PGED  (via drill 0.25)
  Top 0.254: U3.21 57.81,20.93 64.14,14.61 v64.14,13.65 | v64.77,10.16 JP4.4
  Bottom 0.254: v64.14,13.65 64.14,10.79 v64.77,10.16
PRG  (via drill 0.25)
  Top 0.254: C24.1 R16.1 30.67,47.74 S2.P$1 27.94,44.45 v36.2,36.2 | v38.1,34.61 42.86,34.61 v43.81,33.66 | v58.42,32.38 60.38,32.38 U3.32
  Bottom 0.254: v36.2,36.2 37.78,34.61 v38.1,34.61 | v43.81,33.66 44.77,33.66 47.62,30.8 58.42,30.8 v58.42,32.38
RESET  (via drill 0.25)
  Top 0.254: v55.88,15.24 57.47,16.83 57.47,18.41 55.41,20.47 U3.18 55.41,27.14 55.24,27.3 v55.24,29.84 55.24,27.62 | v57.15,10.16 JP4.1 | R15.1 23.38,50.28 24.13,49.53 24.13,44.45 25.4,43.18 27.94,43.18 34.29,36.83 34.29,36.51 v35.24,35.56 | v37.15,33.66 38.42,33.66 38.73,33.97 42.55,33.97 v45.09,31.43
  Bottom 0.254: v55.88,15.24 55.88,11.43 v57.15,10.16 | v35.24,35.56 v37.15,33.66 | v45.09,31.43 46.04,31.43 47.31,30.16 55.24,30.16 v55.24,29.84
RF_GP1
  Top 0.254: JP3.11 91.72,41.43 R8.1
RF_GP3  (via drill 0.25)
  Top 0.254: R2.1 49.53,18.73 v49.85,18.41 | v53.98,13.34 54.61,12.7 56.52,12.7 58.1,14.29 60.64,14.29 v61.28,13.65 | v68.58,19.37 69.53,20.32 78.11,20.32 81.92,24.13 94.52,24.13 JP3.4
  Bottom 0.254: v49.85,18.41 49.85,17.46 v53.98,13.34 | v61.28,13.65 62.87,13.65 v68.58,19.37
RF_NIRQ  (via drill 0.25)
  Top 0.254: R1.1 v48.26,18.41 | v53.34,12.7 53.98,12.06 56.83,12.06 58.1,13.34 60.01,13.34 60.96,12.38 64.45,12.38 69.85,17.78 69.85,19.37 70.17,19.68 78.42,19.68 v81.92,23.18 | v87,38.42 94.53,38.42 JP3.10
  Bottom 0.254: v48.26,18.41 48.26,17.78 v53.34,12.7 | v81.92,23.18 87,28.26 v87,38.42
RF_SDN  (via drill 0.25)
  Top 0.254: R4.1 43.18,38.1 43.18,39.37 R9.2 44.77,39.37 v45.72,38.42 | v47.31,41.59 47.31,42.23 48.26,43.18 49.53,43.18 50.8,44.45 50.8,49.53 58.1,49.53 58.42,49.21 58.42,43.18 59.05,42.55 79.69,42.55 85.41,36.83 89.85,36.83 v90.17,36.51
  Bottom 0.254: v45.72,38.42 45.72,40.01 v47.31,41.59 | v90.17,36.51 90.17,30.16 92.71,27.62 92.71,21.91 93.03,21.59 94.52,21.59 JP3.3
RX  (via drill 0.25)
  Top 0.254: R5.1 66.36,26.67 66.67,26.35 66.67,20 v68.58,18.1 | v70.8,13.97 JP1.3
  Bottom 0.254: v68.58,18.1 68.58,16.19 v70.8,13.97
SCK  (via drill 0.25)
  Top 0.254: U3.15 53.01,21.58 v52.39,20.95 | v61.59,20.95 v64.45,20.95 | v67.63,20.95 77.47,20.95 v88.58,32.07
  Bottom 0.254: v52.39,20.95 52.39,20 54.61,17.78 58.42,17.78 v61.59,20.95 | v64.45,20.95 v67.63,20.95 | v88.58,32.07 88.58,32.38 88.9,32.7 88.9,37.15 89.53,37.78 91.12,37.78 93.03,35.88 94.53,35.88 JP3.9
SCK1  (via drill 0.25)
  Top 0.254: U3.14 52.21,26.81 53.34,27.94 53.34,31.43 v53.66,31.75 | JP2.4 69.85,48.26 67.94,46.35 63.82,46.35 62.23,44.77 v59.05,44.77 | v53.02,37.15 52.7,37.15 52.07,37.78 52.07,40.96 v55.88,44.77
  Bottom 0.254: v53.66,31.75 53.66,32.7 53.02,33.34 v53.02,37.15 | v55.88,44.77 v59.05,44.77
SDI  (via drill 0.25)
  Top 0.254: U3.2 47.6,32.41 47.31,32.7 v47.31,33.97 | v49.53,36.83 v49.53,40.64 | v54.61,40.64 77.47,40.64 84.45,33.66 94.84,33.66 JP3.8
  Bottom 0.254: v47.31,33.97 v49.53,36.83 | v49.53,40.64 v54.61,40.64
SDI1  (via drill 0.25)
  Top 0.254: U3.35 57.81,36.54 v61.28,40.01 | v65.09,43.81 73.66,43.81 74.93,45.09 JP2.6
  Bottom 0.254: v61.28,40.01 v65.09,43.81
SDO  (via drill 0.25)
  Top 0.254: U3.4 47.93,30.81 46.35,32.38 v46.35,34.61 | v48.9,37.78 v48.9,41.27 | v55.24,41.27 78.11,41.27 84.77,34.61 v92.71,34.61
  Bottom 0.254: v46.35,34.61 v48.9,37.78 | v48.9,41.27 v55.24,41.27 | v92.71,34.61 92.71,31.75 94.52,31.75 JP3.7
SDO1  (via drill 0.25)
  Top 0.254: U3.36 57.01,36.69 v60.33,40.01 | v64.14,43.81 64.77,44.45 71.12,44.45 72.39,45.72 JP2.5
  Bottom 0.254: v60.33,40.01 v64.14,43.81
SS  (via drill 0.25)
  Top 0.254: U3.5 47.78,30.01 45.4,32.38 v45.4,35.24 | v48.26,38.73 v48.26,41.91 | v55.88,41.91 78.74,41.91 85.09,35.56 v91.44,35.56
  Bottom 0.254: v45.4,35.24 v48.26,38.73 | v48.26,41.91 v55.88,41.91 | v91.44,35.56 91.44,30.48 92.71,29.21 94.52,29.21 JP3.6
SS1  (via drill 0.25)
  Top 0.254: U3.38 55.41,36.99 v58.42,40.01 | v61.59,43.18 63.82,45.4 69.53,45.4 71.12,46.99 71.12,52.39 71.44,52.7 77.15,52.7 77.47,52.39 JP2.7
  Bottom 0.254: v58.42,40.01 v61.59,43.18
STRUT_GND  (via drill 0.6)
  other vias: 2.54,11.43 2.54,13.97 2.54,16.51 2.54,19.05 2.54,21.59 2.54,36.83 2.54,39.37 2.54,41.91 2.54,44.45 2.54,46.99 10.16,57.15 12.7,57.15 15.24,57.15 17.78,57.15 20.32,57.15 22.86,57.15 25.4,57.15 27.94,57.15 30.48,57.15 33.02,57.15 35.56,57.15 38.1,57.15 40.64,57.15 43.18,57.15 45.72,57.15 48.26,57.15 50.8,57.15 53.34,57.15 55.88,57.15 58.42,57.15 60.96,57.15 63.5,57.15 66.04,57.15 68.58,57.15 71.12,57.15 73.66,57.15 76.2,57.15 78.74,57.15 2.54,24.13 2.54,26.67 2.54,29.21 2.54,31.75 2.54,34.29
  pour Top: 0,59.69 80.01,59.69 80.01,54.61 11.43,54.61 7.3,49.85 7.3,39.69 9.21,37.78 9.21,34.61 6.67,32.07 6.67,27.62 9.21,25.08 9.21,11.75 7.62,10.16 0,10.16
  pour Bottom: 0,59.69 80.01,59.69 80.01,54.61 11.43,54.61 7.3,49.85 7.3,39.69 9.21,37.78 9.21,34.61 6.67,32.07 6.67,27.62 9.21,25.08 9.21,11.75 7.62,10.16 0,10.16
SW1
  Top 0.254: C25.1 R17.1 56.63,47.74 53.9,45.01 S3.P$1 53.34,43.18 50.48,40.32 50.48,37.15 51.44,36.2 51.44,35.03 U3.43
TEMP_SENSE  (via drill 0.25)
  Top 0.254: U4.3 43.08,10.81 C22.1 43.93,10.91 47.31,14.29 56.2,14.29 57.47,15.56 v61.91,15.56 | U3.23 60.41,20.87 v63.82,17.46
  Bottom 0.254: v61.91,15.56 v63.82,17.46
TX  (via drill 0.25)
  Top 0.254: R6.1 65.52,19.57 v67.94,17.14 | v69.85,13.97 77.47,6.35 JP1.2
  Bottom 0.254: v67.94,17.14 67.94,15.88 v69.85,13.97

### Text on the board
Top: ANTARCTICA | GMSK TRX COMMS Board Ver 1. | 13 Jan 2016 | 433 - 460 MHz
tPlace: RESET | PROGRAM | USER | 5V | G | 3V | MOSI | SS | G | SCK | MISO | GP0 | GP1 | NRQ | SCLK | MISO | MOSI | NSEL | GP2 | GP3 | SDN | GND | VDD | GND | RST | GND | TX | RX
tStop: ANTARCTICA | GMSK TRX COMMS Board Ver 1. | 13 Jan 2016 | 433 - 460 MHz